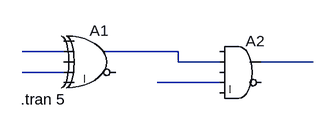
[diagram p0: schematic 2_input_Xor_followed_by_and.asc]
2_input_Xor_followed_by_and.asc, the LTspice schematic file:
Version 4
SHEET 1 880 680
WIRE 96 144 32 144
WIRE 272 144 160 144
WIRE 272 160 272 144
WIRE 336 160 272 160
WIRE 480 160 400 160
WIRE 96 176 32 176
WIRE 336 192 240 192
SYMBOL Digital\\xor 144 96 R0
SYMATTR InstName A1
SYMBOL Digital\\and 368 112 R0
SYMATTR InstName A2
TEXT 30 218 Left 2 !.tran 5

The netlist it stands for:
* 2_input_Xor_followed_by_and.asc
A1 0 N001 0 N004 0 0 N002 0 XOR
A2 0 N002 0 N005 0 0 N003 0 AND
.tran 5
.backanno
.end